# Altium schematic sheet LT3752-Main.SchDoc
size A
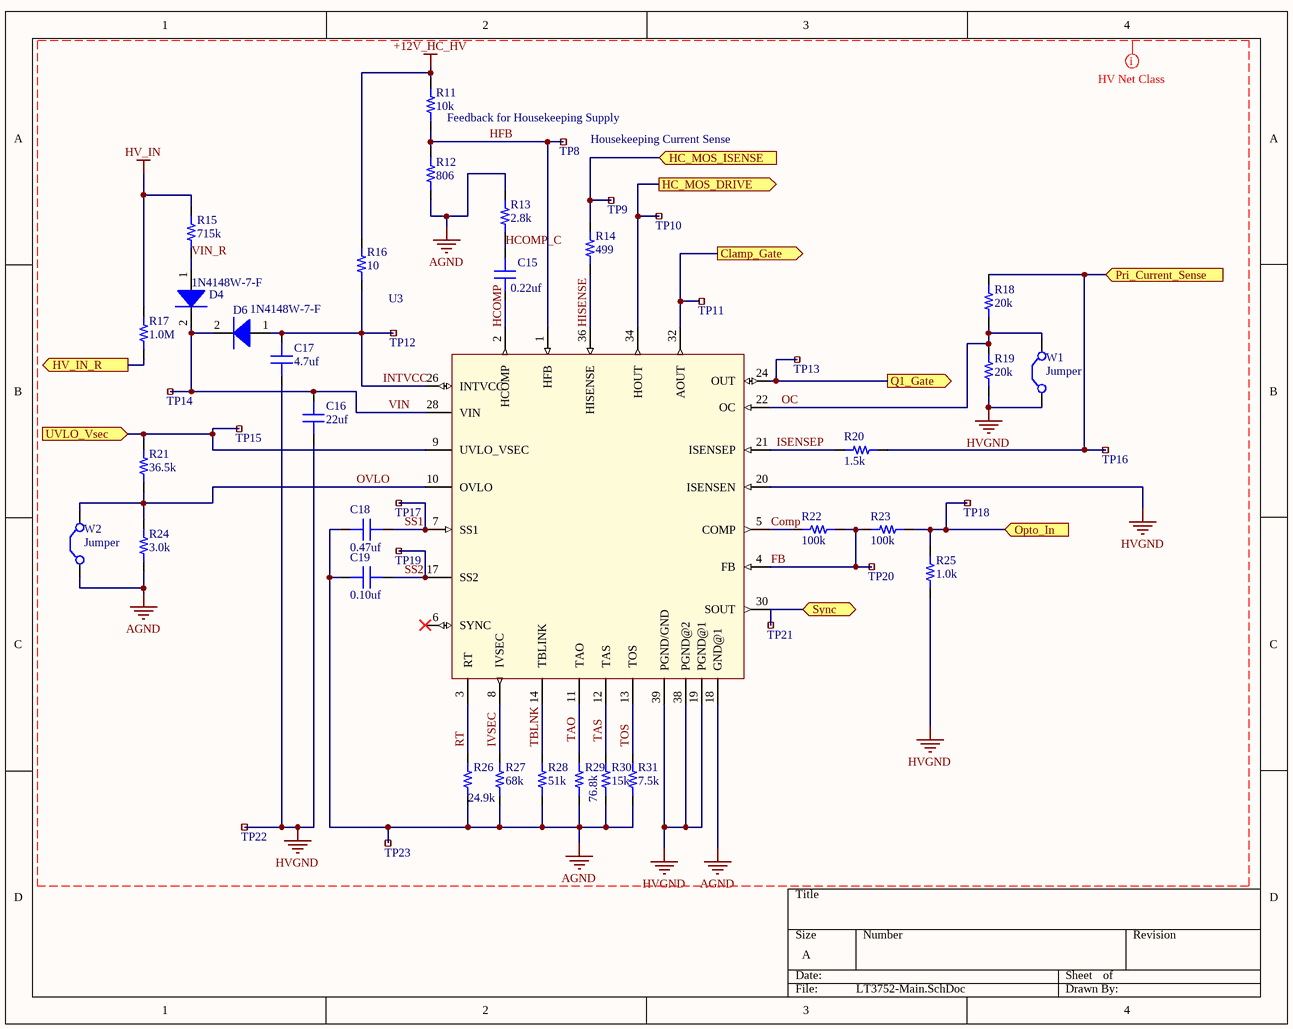
[diagram p0: LT3752-Main.SchDoc]

## Parts
C15  value 0.22uf  [CAP 0603/1608]  (hidden comment: Capacitor MLCC 0.22uf 25V CAP 0603/1608)
C16  value 22uf  [CAP 0805/2012]  (hidden comment: Capacitor MLCC 22uf 25V CAP 0805/2012)
C17  value 4.7uf  [CAP 0805/2012]  (hidden comment: Capacitor MLCC 4.7uf 25V CAP 0805/2012)
C18  value 0.47uf  [CAP 0603/1608]  (hidden comment: Capacitor MLCC 0.47uf 25V CAP 0603/1608)
C19  value 0.10uf  [CAP 0603/1608]  (hidden comment: Capacitor MLCC 0.10uf 25V CAP 0603/1608)
D4  mfrpartno: 1N4148W-7-F  [SOD123F]
D6  mfrpartno: 1N4148W-7-F  [SOD123F]
R11  value 10k  [RES 0603/1608]  (hidden comment: Resistor 10k 0603 1/10W 1%)
R12  value 806  [RES 0603/1608]  (hidden comment: Resistor 806 0603 1/10W 1%)
R13  value 2.8k  [RES 0603/1608]  (hidden comment: Resistor 2.8k 0603 1/10W 1%)
R14  value 499  [RES 0603/1608]  (hidden comment: Resistor 499 0603 1/10W 1%)
R15  value 715k  [RES 1206/3216]  (hidden comment: Resistor 715k 1206 1/4W 1%)
R16  value 10  [RES 0805/2012]  (hidden comment: Resistor 10 0805 1/4W 10%)
R17  value 1.0M  [RES 0603/1608]  (hidden comment: Resistor 1.0M 0603 1/10W 1%)
R18  value 20k  [RES 0603/1608]  (hidden comment: Resistor 20k 0603 1/10W 1%)
R19  value 20k  [RES 0603/1608]  (hidden comment: Resistor 20k 0603 1/10W 1%)
R20  value 1.5k  [RES 0603/1608]  (hidden comment: Resistor 1.5k 0603 1/10W 1%)
R21  value 36.5k  [RES 0603/1608]  (hidden comment: Resistor 36.5k 0603 1/10W 1%)
R22  value 100k  [RES 0603/1608]  (hidden comment: Resistor 100k 0603 1/10W 1%)
R23  value 100k  [RES 0603/1608]  (hidden comment: Resistor 100k 0603 1/10W 1%)
R24  value 3.0k  [RES 0603/1608]  (hidden comment: Resistor 3.0k 0603 1/10W 1%)
R25  value 1.0k  [RES 0805/2012]  (hidden comment: Resistor 1.0k 0805 1/4W 5%)
R26  value 24.9k  [RES 0603/1608]  (hidden comment: Resistor 24.9k 0603 1/10W 1%)
R27  value 68k  [RES 0603/1608]  (hidden comment: Resistor 68k 0603 1/10W 1%)
R28  value 51k  [RES 0603/1608]  (hidden comment: Resistor 51k 0603 1/10W 1%)
R29  value 76.8k  [RES 0603/1608]  (hidden comment: Resistor 76.8k 0603 1/10 1%)
R30  value 15k  [RES 0603/1608]  (hidden comment: Resistor 15k 0603 1/10W 1%)
R31  value 7.5k  [RES 0603/1608]  (hidden comment: Resistor 7.5k 0603 1/10W 1%)
TP8  RCU-0C  [5029]  (value not drawn)
TP9  RCU-0C  [5029]  (value not drawn)
TP10  RCU-0C  [5029]  (value not drawn)
TP11  RCU-0C  [5029]  (value not drawn)
TP12  RCU-0C  [5029]  (value not drawn)
TP13  RCU-0C  [5029]  (value not drawn)
TP14  RCU-0C  [5029]  (value not drawn)
TP15  RCU-0C  [5029]  (value not drawn)
TP16  RCU-0C  [5029]  (value not drawn)
TP17  RCU-0C  [5029]  (value not drawn)
TP18  RCU-0C  [5029]  (value not drawn)
TP19  RCU-0C  [5029]  (value not drawn)
TP20  RCU-0C  [5029]  (value not drawn)
TP21  RCU-0C  [5029]  (value not drawn)
TP22  RCU-0C  [5029]  (value not drawn)
TP23  RCU-0C  [5029]  (value not drawn)
U3  (no value)  [TSSOP-38]
W1  Jumper  [XG8T-0231]
W2  Jumper  [XG8T-0231]

## Ports
Clamp_Gate (out), HC_MOS_DRIVE (out), HC_MOS_ISENSE (in), HV_IN_R (out), Opto_In (in), Pri_Current_Sense (in), Q1_Gate (out), Sync (bidir), UVLO_Vsec (in)

## Nets
+12V_HC_HV: R11.1 R16.1
AGND: C18.1 C19.1 R12.1 R13.2 R24.1 R26.1 R27.1 R28.1 R29.1 R30.1 R31.1 TP23.1 U3.18(GND@1) W2.1(C1)
HV_IN: R15.2 R17.1
HVGND: C16.1 C17.1 R19.1 R25.1 TP22.1 U3.19(PGND@1) U3.20(ISENSEN) U3.38(PGND@2) U3.39(PGND/GND) W1.1(C1)
Clamp_Gate: TP11.1 U3.32(AOUT) ; port Clamp_Gate
Comp: R22.1 U3.5(COMP)
FB: R22.2 R23.1 TP20.1 U3.4(FB)
HC_MOS_DRIVE: TP10.1 U3.34(HOUT) ; port HC_MOS_DRIVE
HC_MOS_ISENSE: R14.2 TP9.1 ; port HC_MOS_ISENSE
HCOMP: C15.1 U3.2(HCOMP)
HCOMP_C: C15.2 R13.1
HFB: R11.2 R12.2 TP8.1 U3.1(HFB)
HISENSE: R14.1 U3.36(HISENSE)
HV_IN_R: R17.2 ; port HV_IN_R
INTVCC: C17.2 D6.1(A) R16.2 TP12.1 U3.26(INTVCC)
ISENSEP: R20.1 U3.21(ISENSEP)
IVSEC: R27.2 U3.8(IVSEC)
OC: R18.1 R19.2 U3.22(OC) W1.2(C2)
Opto_In: R23.2 R25.2 TP18.1 ; port Opto_In
OVLO: R21.1 R24.2 U3.10(OVLO) W2.2(C2)
Pri_Current_Sense: R18.2 R20.2 TP16.1 ; port Pri_Current_Sense
Q1_Gate: TP13.1 U3.24(OUT) ; port Q1_Gate
RT: R26.2 U3.3(RT)
SS1: C18.2 TP17.1 U3.7(SS1)
SS2: C19.2 TP19.1 U3.17(SS2)
Sync: TP21.1 U3.30(SOUT) ; port Sync
TAO: R29.2 U3.11(TAO)
TAS: R30.2 U3.12(TAS)
TBLNK: R28.2 U3.14(TBLINK)
TOS: R31.2 U3.13(TOS)
UVLO_Vsec: R21.2 TP15.1 U3.9(UVLO_VSEC) ; port UVLO_Vsec
VIN: C16.2 D4.2(K) D6.2(K) TP14.1 U3.28(VIN)
VIN_R: D4.1(A) R15.1

Not connected (* = marked no-connect by the designer): U3 6(SYNC)*

## Layout directives
net class HV: +12V_HC_HV, AGND, Comp, FB, HCOMP, HCOMP_C, HFB, HISENSE, HV_IN, HVGND, INTVCC, ISENSEP, IVSEC, OC, OVLO, RT, SS1, SS2, TAO, TAS, TBLNK, TOS, VIN, VIN_R

## Notes on the sheet
- Feedback for Housekeeping Supply
- (near TP8) Housekeeping Current Sense

## Library data of the parts
C15 = 585: Manufacturer_id: 1; idCapacitor: 585; Name: Cap_0.22uf_25V_CAP 0603/1608; Dielectric: Ceramic; Created_By: Nick Mah; Drawer_id: 1; Voltage_Rating: 25V; Package: CAP 0603/1608; Created_Date: 10/20/2018
C16 = 717: Manufacturer_id: 1; idCapacitor: 717; Name: Cap_22uf_25V_CAP 0805/2012; Dielectric: Ceramic; Created_By: Nick Mah; Drawer_id: 1; Voltage_Rating: 25V; Package: CAP 0805/2012; Created_Date: 10/20/2018
C17 = 713: Manufacturer_id: 1; idCapacitor: 713; Name: Cap_4.7uf_25V_CAP 0805/2012; Dielectric: Ceramic; Created_By: Nick Mah; Drawer_id: 1; Voltage_Rating: 25V; Package: CAP 0805/2012; Created_Date: 10/20/2018
C18 = 587: Manufacturer_id: 1; idCapacitor: 587; Name: Cap_0.47uf_25V_CAP 0603/1608; Dielectric: Ceramic; Created_By: Nick Mah; Drawer_id: 1; Voltage_Rating: 25V; Package: CAP 0603/1608; Created_Date: 10/20/2018
C19 = 583: Manufacturer_id: 1; idCapacitor: 583; Name: Cap_0.10uf_25V_CAP 0603/1608; Dielectric: Ceramic; Created_By: Nick Mah; Drawer_id: 1; Voltage_Rating: 25V; Package: CAP 0603/1608; Created_Date: 10/20/2018
D4 D6 = 4: 100V Reverse DC Voltage; Manufacturer_id: 1; idDiode: 4; Value: Vf-1.25V,Vr-100V; Type: Standard; Ic: 300 mA; Drawer_id: 1; Name: 1N4148W-7-F; Num_Circuits: 1; Package: SOD123; Link: https://www.digikey.com/product-detail/en/diodes-incorporated/1N4148W-7-F/1N4148W-FDICT-ND/815280
R11 = 313: Manufacturer_id: 1; idResistor: 313; Name: Res_10k_0603_1/10W_1%; Created_By: Nick Mah; Supplier 1: Digi-Key; Drawer_id: 1; Tolerance: 1%; Power: 1/10W; Package: 0603; ComponentLink1Description: Datasheet; Created_Date: 2018-10-20
R12 = 2720: Manufacturer_id: 1; idResistor: 2720; Name: Res_806_0603_1/10W_1%; Created_By: Nick Mah; Supplier 1: Digi-Key; Supplier Part Number 1: Digi-Key; Drawer_id: 1; Tolerance: 1%; Power: 1/10W; Package: 0603; ComponentLink1Description: Datasheet
R13 = 2722: Manufacturer_id: 1; idResistor: 2722; Name: Res_2.8k_0603_1/10W_1%; Created_By: Nick Mah; Supplier 1: Digi-Key; Supplier Part Number 1: Digi-Key; Drawer_id: 1; Tolerance: 1%; Power: 1/10W; Package: 0603; ComponentLink1Description: Datasheet
R14 = 2723: Manufacturer_id: 1; idResistor: 2723; Name: Res_499_1/10W_1%; Created_By: Nick Mah; Supplier 1: Digi-Key; Supplier Part Number 1: Digi-Key; Drawer_id: 1; Tolerance: 1%; Power: 1/10W; Package: 0603; ComponentLink1Description: Datasheet
R15 = 2719: Manufacturer_id: 1; idResistor: 2719; Name: Res_715k_1206_1/4W_1; Created_By: Nick Mah; Supplier 1: Digi-Key; Supplier Part Number 1: Digi-Key; Drawer_id: 1; Tolerance: 1%; Power: 1/4W; Package: 1206; ComponentLink1Description: Datasheet
R16 = 2497: Manufacturer_id: 1; idResistor: 2497; Name: Res_10_0805_1/4W_10%; Created_By: Nick Mah; Supplier 1: Digi-Key; Drawer_id: 1; Tolerance: 10%; Power: 1/4W; Package: 0805; ComponentLink1Description: Datasheet; Created_Date: 2018-10-20
R17 = 361: Manufacturer_id: 1; idResistor: 361; Name: Res_1.0M_0603_1/10W_1%; Created_By: Nick Mah; Supplier 1: Digi-Key; Drawer_id: 1; Tolerance: 1%; Power: 1/10W; Package: 0603; ComponentLink1Description: Datasheet; Created_Date: 2018-10-20
R18 R19 = 320: Manufacturer_id: 1; idResistor: 320; Name: Res_20k_0603_1/10W_1%; Created_By: Nick Mah; Supplier 1: Digi-Key; Drawer_id: 1; Tolerance: 1%; Power: 1/10W; Package: 0603; ComponentLink1Description: Datasheet; Created_Date: 2018-10-20
R20 = 293: Manufacturer_id: 1; idResistor: 293; Name: Res_1.5k_0603_1/10W_1%; Created_By: Nick Mah; Supplier 1: Digi-Key; Drawer_id: 1; Tolerance: 1%; Power: 1/10W; Package: 0603; ComponentLink1Description: Datasheet; Created_Date: 2018-10-20
R21 = 2718: Manufacturer_id: 1; idResistor: 2718; Name: Res_36.5k_0603_1/10W_1%; Created_By: Nick Mah; Supplier 1: Digi-Key; Supplier Part Number 1: Digi-Key; Drawer_id: 1; Tolerance: 1%; Power: 1/10W; Package: 0603; ComponentLink1Description: Datasheet
R22 R23 = 337: Manufacturer_id: 1; idResistor: 337; Name: Res_100k_0603_1/10W_1%; Created_By: Nick Mah; Supplier 1: Digi-Key; Drawer_id: 1; Tolerance: 1%; Power: 1/10W; Package: 0603; ComponentLink1Description: Datasheet; Created_Date: 2018-10-20
R24 = 300: Manufacturer_id: 1; idResistor: 300; Name: Res_3.0k_0603_1/10W_1%; Created_By: Nick Mah; Supplier 1: Digi-Key; Drawer_id: 1; Tolerance: 1%; Power: 1/10W; Package: 0603; ComponentLink1Description: Datasheet; Created_Date: 2018-10-20
R25 = 1801: Manufacturer_id: 1; idResistor: 1801; Name: Res_1.0k_0805_1/4W_5%; Created_By: Nick Mah; Supplier 1: Digi-Key; Drawer_id: 1; Tolerance: 5%; Power: 1/4W; Package: 0805; ComponentLink1Description: Datasheet; Created_Date: 2018-10-20
R26 = 2716: Manufacturer_id: 1; idResistor: 2716; Name: Res_24.9k_0603_1/10W_1%; Created_By: Nick Mah; Supplier 1: Digi-Key; Supplier Part Number 1: Digi-Key; Drawer_id: 1; Tolerance: 1%; Power: 1/10W; Package: 0603; ComponentLink1Description: Datasheet
R27 = 333: Manufacturer_id: 1; idResistor: 333; Name: Res_68k_0603_1/10W_1%; Created_By: Nick Mah; Supplier 1: Digi-Key; Drawer_id: 1; Tolerance: 1%; Power: 1/10W; Package: 0603; ComponentLink1Description: Datasheet; Created_Date: 2018-10-20
R28 = 330: Manufacturer_id: 1; idResistor: 330; Name: Res_51k_0603_1/10W_1%; Created_By: Nick Mah; Supplier 1: Digi-Key; Drawer_id: 1; Tolerance: 1%; Power: 1/10W; Package: 0603; ComponentLink1Description: Datasheet; Created_Date: 2018-10-20
R29 = 2717: Manufacturer_id: 1; idResistor: 2717; Name: Res_76.8k_0603_1/10W_1%; Power: 1/10W; Created_By: Nick Mah; Supplier 1: Digi-Key; Supplier Part Number 1: Digi-Key; Drawer_id: 1; Tolerance: 1%; Package: 0603; ComponentLink1Description: Datasheet
R30 = 317: Manufacturer_id: 1; idResistor: 317; Name: Res_15k_0603_1/10W_1%; Created_By: Nick Mah; Supplier 1: Digi-Key; Drawer_id: 1; Tolerance: 1%; Power: 1/10W; Package: 0603; ComponentLink1Description: Datasheet; Created_Date: 2018-10-20
R31 = 310: Manufacturer_id: 1; idResistor: 310; Name: Res_7.5k_0603_1/10W_1%; Created_By: Nick Mah; Supplier 1: Digi-Key; Drawer_id: 1; Tolerance: 1%; Power: 1/10W; Package: 0603; ComponentLink1Description: Datasheet; Created_Date: 2018-10-20
TP8-TP23 = 28: Test point; Manufacturer_id: 1; idConn: 28; Value: CONN; Created_By: Jason Zhou; Drawer_id: 1; Name: 5029; Num_Contacts: 1; Num_Rows: 1; Package: 5029; MfrPartNo: 5029; Link: https://www.digikey.com/product-detail/en/keystone-electronics/5029/36-5029CT-ND/5980631; ComponentLink1Description: Datasheet; ComponentLink1URL: file:///C:/Users/Jason%20Zhou/Downloads/5029.PDF; Supplier1: Digi-Key; Supplier1PartNo: 36-5029CT-ND; Created_Date: 4/26/2019
U3 = 3: Forward Converter Regulator Positive, Isolation Capable Output Step-Up/Step-Down DC-DC Controller IC 6.5-100V Input; Manufacturer_id: 1; MfrPartNo: LT3752FE-1; MF: Linear Technology/Analog; MP: LT3752EFE-1#PBF; idPMIC_SW: 3; Name: LT3752-1 DC-DC Converter; Discrete: No; Power: 400W; Topology: Isolated Forward; Vin(Min): 6.5V; Vin(Max): 100V; Vout_Type: Adjustable; Fs: 100-500kHz; Created_By: Jason; Availability: Unavailable; Price: None; Package: 38-TSSOP; SnapEDA_Link: https://www.snapeda.com/parts/LT3752EFE-1%23PBF/Analog%20Devices/view-part/?ref=snap; Value: Forward; Drawer_id: 1; Num_Outputs: 1; Link: https://www.digikey.com/product-detail/en/linear-technology-analog-devices/LT3752EFE-1-PBF/LT3752EFE-1-PBF-ND/4814575; ComponentLink1Description: Datasheet; ComponentLink1URL: https://www.analog.com/media/en/technical-documentation/data-sheets/8311f.pdf; Supplier1: Digi-Key; Supplier1PartNo: LT3752EFE-1#PBF-ND
W1 W2 = 18: Jumper headers; Manufacturer_id: 1; idFuse: 3; idConn: 18; Num_Contacts: 2; Pitch: .1 mm; Drawer_id: 1; Name: XG8T-0231; Value: Jumper; Num_Rows: 1; MfrPartNo: XG8T-0231; Link: https://www.digikey.ca/product-detail/en/omron-electronics-inc-emc-div/XG8T-0231/XG8T-0231-ND/1829453; ComponentLink1Description: Datasheet; Supplier1: Digi-Key